# EAGLE schematic Sequencer-Logic-Prod-V2.1l (EAGLE 9.6.2)

## Sheet 1 of 10: uCode PC Counter
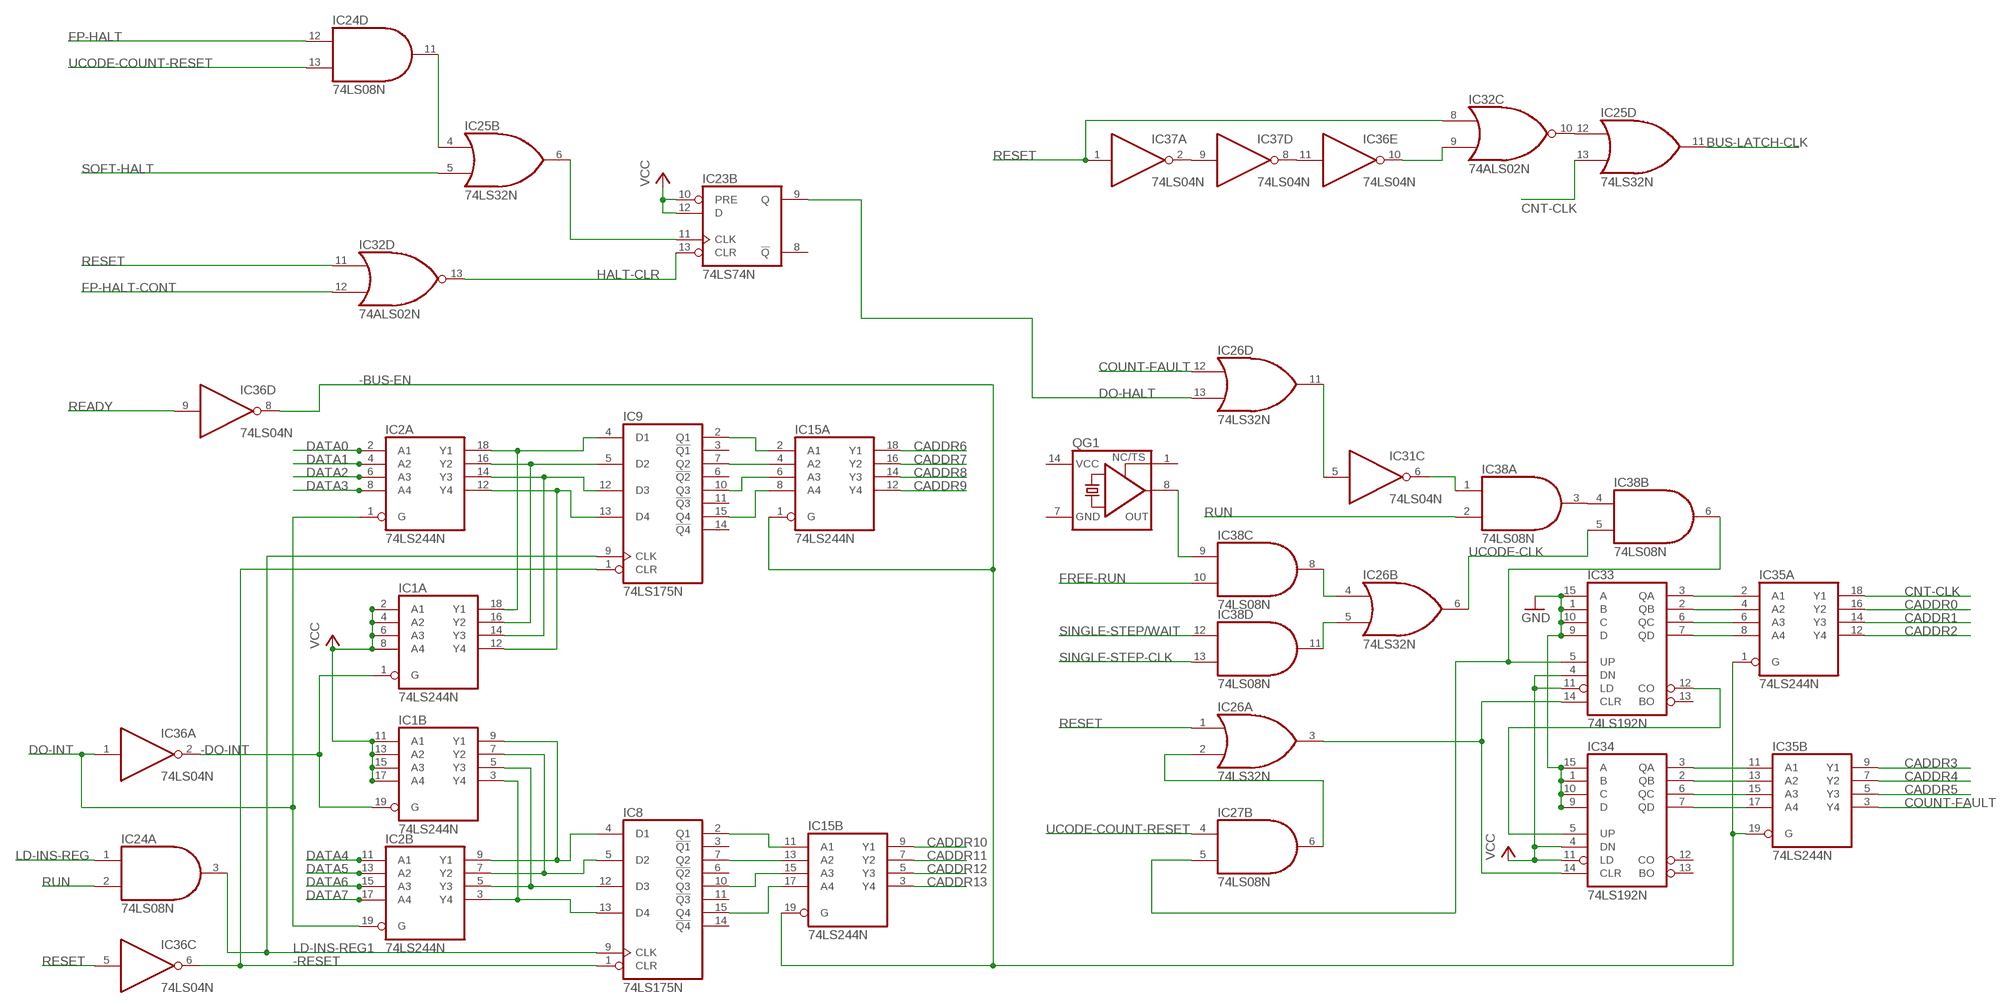
[diagram p0: schematic, sheet 1]

### Parts
IC1  74LS244N  [DIL20]
IC2  74LS244N  [DIL20]
IC8  74LS175N  [DIL16]
IC9  74LS175N  [DIL16]
IC15  74LS244N  [DIL20]
IC23  74LS74N  [DIL14]
IC24  74LS08N  [DIL14]
IC25  74LS32N  [DIL14]
IC26  74LS32N  [DIL14]
IC27  74LS08N  [DIL14]
IC31  74LS04N  [DIL14]
IC32  74ALS02N  [DIL14]
IC33  74LS192N  [DIL16]
IC34  74LS192N  [DIL16]
IC35  74LS244N  [DIL20]
IC36  74LS04N  [DIL14]
IC37  74LS04N  [DIL14]
IC38  74LS08N  [DIL14]
QG1  XO-14  [DIL14S]

### Nets
-BUS-EN: IC15.1(A:G) IC15.19(B:G) IC35.1(A:G) IC35.19(B:G) IC36.8(D:O) ; also sheet 2,10
-DO-INT: IC1.1(A:G) IC1.19(B:G) IC36.2(A:O)
-RESET: IC8.1(CLR) IC9.1(CLR) IC36.6(C:O) ; also sheet 10
BUS-LATCH-CLK: IC25.11(D:O) ; also sheet 2
CADDR0: IC35.16(A:Y2) ; also sheet 9
CADDR1: IC35.14(A:Y3) ; also sheet 9
CADDR2: IC35.12(A:Y4) ; also sheet 9
CADDR3: IC35.9(B:Y1) ; also sheet 9
CADDR4: IC35.7(B:Y2) ; also sheet 9
CADDR5: IC35.5(B:Y3) ; also sheet 9
CADDR6: IC15.18(A:Y1) ; also sheet 9
CADDR7: IC15.16(A:Y2) ; also sheet 9
CADDR8: IC15.14(A:Y3) ; also sheet 9
CADDR9: IC15.12(A:Y4) ; also sheet 9
CADDR10: IC15.9(B:Y1) ; also sheet 9
CADDR11: IC15.7(B:Y2) ; also sheet 9
CADDR12: IC15.5(B:Y3) ; also sheet 9
CADDR13: IC15.3(B:Y4) ; also sheet 9
CNT-CLK: IC25.13(D:I1) IC35.18(A:Y1)
COUNT-FAULT: IC26.12(D:I0) IC35.3(B:Y4)
COUNT-RESET: IC26.3(A:O) IC33.14(CLR) IC34.14(CLR)
DATA0: IC2.2(A:A1) ; also sheet 4,6,10
DATA1: IC2.4(A:A2) ; also sheet 4,6,10
DATA2: IC2.6(A:A3) ; also sheet 4,6,10
DATA3: IC2.8(A:A4) ; also sheet 4,6,10
DATA4: IC2.11(B:A1) ; also sheet 4,6,10
DATA5: IC2.13(B:A2) ; also sheet 4,6,10
DATA6: IC2.15(B:A3) ; also sheet 4,6,10
DATA7: IC2.17(B:A4) ; also sheet 4,6,10
DO-HALT: IC23.9(B:Q) IC26.13(D:I1)
DO-INT: IC2.1(A:G) IC2.19(B:G) IC36.1(A:I) ; also sheet 3
FP-HALT: IC24.12(D:I0) ; also sheet 5
FP-HALT-CONT: IC32.12(D:I1) ; also sheet 5
FREE-RUN: IC38.10(C:I1) ; also sheet 5
GND: IC33.1(B) IC33.9(D) IC33.10(C) IC33.15(A) IC34.1(B) IC34.9(D) IC34.10(C) IC34.15(A) ; also sheet 3,5,6,7,8,9,10
HALT-CLR: IC23.13(B:CLR) IC32.13(D:O)
LD-INS-REG: IC24.1(A:I0) ; also sheet 2
LD-INS-REG1: IC8.9(CLK) IC9.9(CLK) IC24.3(A:O)
N$1: IC33.12(CO) IC34.5(UP)
N$2: IC9.2(Q1) IC15.2(A:A1)
N$3: IC9.7(Q2) IC15.4(A:A2)
N$4: IC27.5(B:I1) IC33.5(UP) IC38.6(B:O)
N$5: IC1.18(A:Y1) IC2.18(A:Y1) IC9.4(D1)
N$6: IC1.16(A:Y2) IC2.16(A:Y2) IC9.5(D2)
N$7: IC33.3(QA) IC35.2(A:A1)
N$8: IC33.2(QB) IC35.4(A:A2)
N$9: IC33.6(QC) IC35.6(A:A3)
N$10: IC9.10(Q3) IC15.6(A:A3)
N$11: IC33.7(QD) IC35.8(A:A4)
N$12: IC34.3(QA) IC35.11(B:A1)
N$13: IC34.2(QB) IC35.13(B:A2)
N$14: IC34.6(QC) IC35.15(B:A3)
N$15: IC34.7(QD) IC35.17(B:A4)
N$16: IC31.6(C:O) IC38.1(A:I0)
N$17: IC1.14(A:Y3) IC2.14(A:Y3) IC9.12(D3)
N$18: IC1.12(A:Y4) IC2.12(A:Y4) IC9.13(D4)
N$19: IC1.9(B:Y1) IC2.9(B:Y1) IC8.4(D1)
N$20: IC1.7(B:Y2) IC2.7(B:Y2) IC8.5(D2)
N$21: IC1.5(B:Y3) IC2.5(B:Y3) IC8.12(D3)
N$22: IC1.3(B:Y4) IC2.3(B:Y4) IC8.13(D4)
N$23: IC9.15(Q4) IC15.8(A:A4)
N$26: IC26.11(D:O) IC31.5(C:I)
N$31: IC38.3(A:O) IC38.4(B:I0)
N$32: IC25.12(D:I0) IC32.10(C:O)
N$33: IC23.11(B:CLK) IC25.6(B:O)
N$34: IC8.2(Q1) IC15.11(B:A1)
N$35: IC8.7(Q2) IC15.13(B:A2)
N$36: IC8.10(Q3) IC15.15(B:A3)
N$37: IC8.15(Q4) IC15.17(B:A4)
N$38: IC26.5(B:I1) IC38.11(D:O)
N$39: IC26.4(B:I0) IC38.8(C:O)
N$40: IC38.9(C:I0) QG1.8(OUT)
N$42: IC36.11(E:I) IC37.8(D:O)
N$44: IC37.2(A:O) IC37.9(D:I)
N$46: IC32.9(C:I1) IC36.10(E:O)
N$54: IC24.11(D:O) IC25.4(B:I0)
N$55: IC26.2(A:I1) IC27.6(B:O)
READY: IC36.9(D:I) ; also sheet 9
RESET: IC26.1(A:I0) IC32.8(C:I0) IC32.11(D:I0) IC36.5(C:I) IC37.1(A:I) ; also sheet 3,5
RUN: IC24.2(A:I1) IC38.2(A:I1) ; also sheet 5
SINGLE-STEP-CLK: IC38.13(D:I1) ; also sheet 5
SINGLE-STEP/WAIT: IC38.12(D:I0) ; also sheet 5
SOFT-HALT: IC25.5(B:I1) ; also sheet 2
UCODE-CLK: IC26.6(B:O) IC38.5(B:I1)
UCODE-COUNT-RESET: IC24.13(D:I1) IC27.4(B:I0) ; also sheet 2,4,5
VCC: IC1.2(A:A1) IC1.4(A:A2) IC1.6(A:A3) IC1.8(A:A4) IC1.11(B:A1) IC1.13(B:A2) IC1.15(B:A3) IC1.17(B:A4) IC23.10(B:PRE) IC23.12(B:D) IC33.4(DN) IC33.11(LD) IC34.4(DN) IC34.11(LD) ; also sheet 3,5,7,9,10
Unconnected: IC8.3(!Q1) IC8.6(!Q2) IC8.11(!Q3) IC8.14(!Q4) IC9.3(!Q1) IC9.6(!Q2) IC9.11(!Q3) IC9.14(!Q4) IC23.8(B:!Q) IC33.13(BO) IC34.12(CO) IC34.13(BO) QG1.1(TS)

## Sheet 2 of 10: Latching
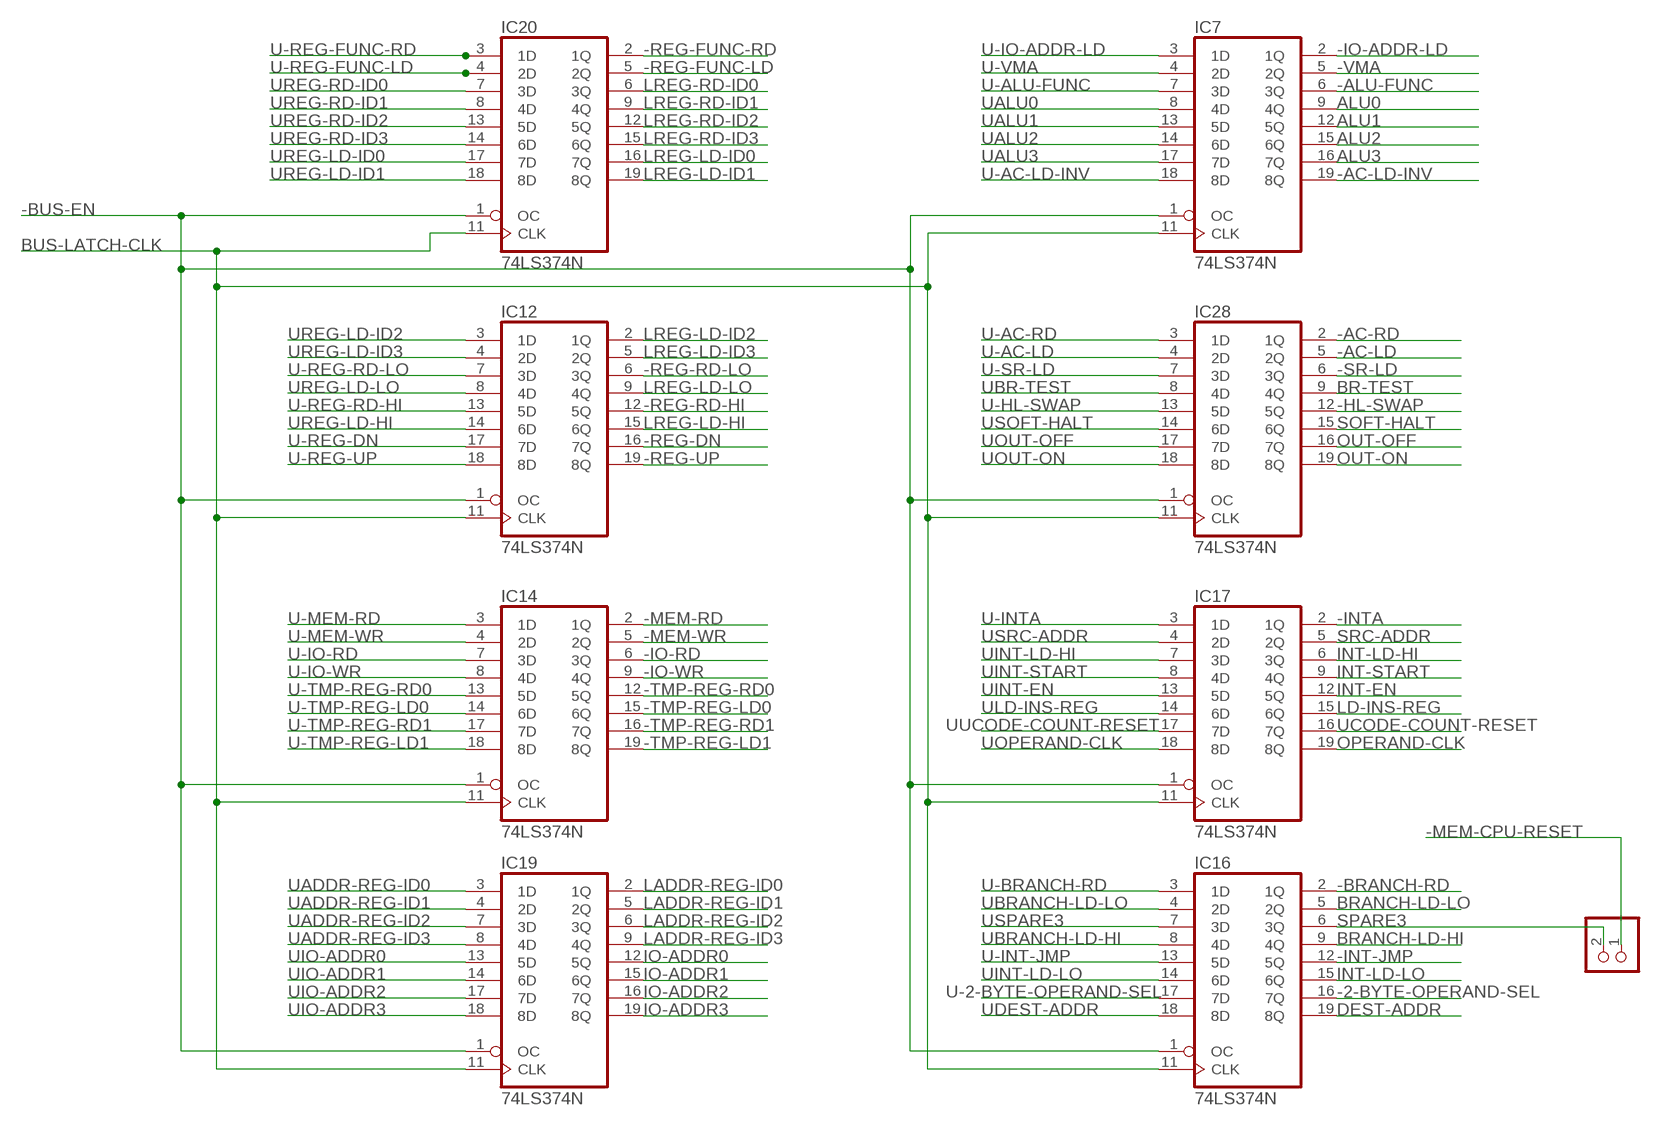
[diagram p1: schematic, sheet 2]

### Parts
IC7  74LS374N  [DIL20]
IC12  74LS374N  [DIL20]
IC14  74LS374N  [DIL20]
IC16  74LS374N  [DIL20]
IC17  74LS374N  [DIL20]
IC19  74LS374N  [DIL20]
IC20  74LS374N  [DIL20]
IC28  74LS374N  [DIL20]
JP2  PINHD-1X2  [1X02]

### Nets
-2-BYTE-OPERAND-SEL: IC16.16(7Q) ; also sheet 6
-AC-LD: IC28.5(2Q) ; also sheet 10
-AC-LD-INV: IC7.19(8Q) ; also sheet 10
-AC-RD: IC28.2(1Q) ; also sheet 10
-ALU-FUNC: IC7.6(3Q) ; also sheet 10
-BRANCH-RD: IC16.2(1Q) ; also sheet 4
-BUS-EN: IC7.1(OC) IC12.1(OC) IC14.1(OC) IC16.1(OC) IC17.1(OC) IC19.1(OC) IC20.1(OC) IC28.1(OC) ; also sheet 1,10
-HL-SWAP: IC28.12(5Q) ; also sheet 10
-INT-JMP: IC16.12(5Q) ; also sheet 4
-INTA: IC17.2(1Q) ; also sheet 10
-IO-ADDR-LD: IC7.2(1Q) ; also sheet 10
-IO-RD: IC14.6(3Q) ; also sheet 10
-IO-WR: IC14.9(4Q) ; also sheet 10
-MEM-CPU-RESET: JP2.1 ; also sheet 9
-MEM-RD: IC14.2(1Q) ; also sheet 10
-MEM-WR: IC14.5(2Q) ; also sheet 10
-REG-DN: IC12.16(7Q) ; also sheet 10
-REG-FUNC-LD: IC20.5(2Q) ; also sheet 10
-REG-FUNC-RD: IC20.2(1Q) ; also sheet 10
-REG-RD-HI: IC12.12(5Q) ; also sheet 10
-REG-RD-LO: IC12.6(3Q) ; also sheet 10
-REG-UP: IC12.19(8Q) ; also sheet 10
-SR-LD: IC28.6(3Q) ; also sheet 10
-TMP-REG-LD0: IC14.15(6Q) ; also sheet 10
-TMP-REG-LD1: IC14.19(8Q) ; also sheet 10
-TMP-REG-RD0: IC14.12(5Q) ; also sheet 10
-TMP-REG-RD1: IC14.16(7Q) ; also sheet 10
-VMA: IC7.5(2Q) ; also sheet 10
ALU0: IC7.9(4Q) ; also sheet 10
ALU1: IC7.12(5Q) ; also sheet 10
ALU2: IC7.15(6Q) ; also sheet 10
ALU3: IC7.16(7Q) ; also sheet 10
BR-TEST: IC28.9(4Q) ; also sheet 4
BRANCH-LD-HI: IC16.9(4Q) ; also sheet 4
BRANCH-LD-LO: IC16.5(2Q) ; also sheet 4
BUS-LATCH-CLK: IC7.11(CLK) IC12.11(CLK) IC14.11(CLK) IC16.11(CLK) IC17.11(CLK) IC19.11(CLK) IC20.11(CLK) IC28.11(CLK) ; also sheet 1
DEST-ADDR: IC16.19(8Q) ; also sheet 6
INT-EN: IC17.12(5Q) ; also sheet 3
INT-LD-HI: IC17.6(3Q) ; also sheet 4
INT-LD-LO: IC16.15(6Q) ; also sheet 4
INT-START: IC17.9(4Q) ; also sheet 3
IO-ADDR0: IC19.12(5Q) ; also sheet 10
IO-ADDR1: IC19.15(6Q) ; also sheet 10
IO-ADDR2: IC19.16(7Q) ; also sheet 10
IO-ADDR3: IC19.19(8Q) ; also sheet 10
LADDR-REG-ID0: IC19.2(1Q) ; also sheet 6
LADDR-REG-ID1: IC19.5(2Q) ; also sheet 6
LADDR-REG-ID2: IC19.6(3Q) ; also sheet 6
LADDR-REG-ID3: IC19.9(4Q) ; also sheet 6
LD-INS-REG: IC17.15(6Q) ; also sheet 1
LREG-LD-HI: IC12.15(6Q) ; also sheet 4
LREG-LD-ID0: IC20.16(7Q) ; also sheet 6
LREG-LD-ID1: IC20.19(8Q) ; also sheet 6
LREG-LD-ID2: IC12.2(1Q) ; also sheet 6
LREG-LD-ID3: IC12.5(2Q) ; also sheet 6
LREG-LD-LO: IC12.9(4Q) ; also sheet 4
LREG-RD-ID0: IC20.6(3Q) ; also sheet 6
LREG-RD-ID1: IC20.9(4Q) ; also sheet 6
LREG-RD-ID2: IC20.12(5Q) ; also sheet 6
LREG-RD-ID3: IC20.15(6Q) ; also sheet 6
OPERAND-CLK: IC17.19(8Q) ; also sheet 6
OUT-OFF: IC28.16(7Q) ; also sheet 3
OUT-ON: IC28.19(8Q) ; also sheet 3
SOFT-HALT: IC28.15(6Q) ; also sheet 1
SPARE3: IC16.6(3Q) JP2.2
SRC-ADDR: IC17.5(2Q) ; also sheet 6
U-2-BYTE-OPERAND-SEL: IC16.17(7D) ; also sheet 9
U-AC-LD: IC28.4(2D) ; also sheet 9
U-AC-LD-INV: IC7.18(8D) ; also sheet 9
U-AC-RD: IC28.3(1D) ; also sheet 9
U-ALU-FUNC: IC7.7(3D) ; also sheet 9
U-BRANCH-RD: IC16.3(1D) ; also sheet 9
U-HL-SWAP: IC28.13(5D) ; also sheet 9
U-INT-JMP: IC16.13(5D) ; also sheet 9
U-INTA: IC17.3(1D) ; also sheet 9
U-IO-ADDR-LD: IC7.3(1D) ; also sheet 9
U-IO-RD: IC14.7(3D) ; also sheet 9
U-IO-WR: IC14.8(4D) ; also sheet 9
U-MEM-RD: IC14.3(1D) ; also sheet 9
U-MEM-WR: IC14.4(2D) ; also sheet 9
U-REG-DN: IC12.17(7D) ; also sheet 9
U-REG-FUNC-LD: IC20.4(2D) ; also sheet 9
U-REG-FUNC-RD: IC20.3(1D) ; also sheet 9
U-REG-RD-HI: IC12.13(5D) ; also sheet 9
U-REG-RD-LO: IC12.7(3D) ; also sheet 9
U-REG-UP: IC12.18(8D) ; also sheet 9
U-SR-LD: IC28.7(3D) ; also sheet 9
U-TMP-REG-LD0: IC14.14(6D) ; also sheet 9
U-TMP-REG-LD1: IC14.18(8D) ; also sheet 9
U-TMP-REG-RD0: IC14.13(5D) ; also sheet 9
U-TMP-REG-RD1: IC14.17(7D) ; also sheet 9
U-VMA: IC7.4(2D) ; also sheet 9
UADDR-REG-ID0: IC19.3(1D) ; also sheet 9
UADDR-REG-ID1: IC19.4(2D) ; also sheet 9
UADDR-REG-ID2: IC19.7(3D) ; also sheet 9
UADDR-REG-ID3: IC19.8(4D) ; also sheet 9
UALU0: IC7.8(4D) ; also sheet 9
UALU1: IC7.13(5D) ; also sheet 9
UALU2: IC7.14(6D) ; also sheet 9
UALU3: IC7.17(7D) ; also sheet 9
UBR-TEST: IC28.8(4D) ; also sheet 9
UBRANCH-LD-HI: IC16.8(4D) ; also sheet 9
UBRANCH-LD-LO: IC16.4(2D) ; also sheet 9
UCODE-COUNT-RESET: IC17.16(7Q) ; also sheet 1,4,5
UDEST-ADDR: IC16.18(8D) ; also sheet 9
UINT-EN: IC17.13(5D) ; also sheet 9
UINT-LD-HI: IC17.7(3D) ; also sheet 9
UINT-LD-LO: IC16.14(6D) ; also sheet 9
UINT-START: IC17.8(4D) ; also sheet 9
UIO-ADDR0: IC19.13(5D) ; also sheet 9
UIO-ADDR1: IC19.14(6D) ; also sheet 9
UIO-ADDR2: IC19.17(7D) ; also sheet 9
UIO-ADDR3: IC19.18(8D) ; also sheet 9
ULD-INS-REG: IC17.14(6D) ; also sheet 9
UOPERAND-CLK: IC17.18(8D) ; also sheet 9
UOUT-OFF: IC28.17(7D) ; also sheet 9
UOUT-ON: IC28.18(8D) ; also sheet 9
UREG-LD-HI: IC12.14(6D) ; also sheet 9
UREG-LD-ID0: IC20.17(7D) ; also sheet 9
UREG-LD-ID1: IC20.18(8D) ; also sheet 9
UREG-LD-ID2: IC12.3(1D) ; also sheet 9
UREG-LD-ID3: IC12.4(2D) ; also sheet 9
UREG-LD-LO: IC12.8(4D) ; also sheet 9
UREG-RD-ID0: IC20.7(3D) ; also sheet 9
UREG-RD-ID1: IC20.8(4D) ; also sheet 9
UREG-RD-ID2: IC20.13(5D) ; also sheet 9
UREG-RD-ID3: IC20.14(6D) ; also sheet 9
USOFT-HALT: IC28.14(6D) ; also sheet 9
USPARE3: IC16.7(3D) ; also sheet 9
USRC-ADDR: IC17.4(2D) ; also sheet 9
UUCODE-COUNT-RESET: IC17.17(7D) ; also sheet 9

## Sheet 3 of 10: Interrupt Mgmt
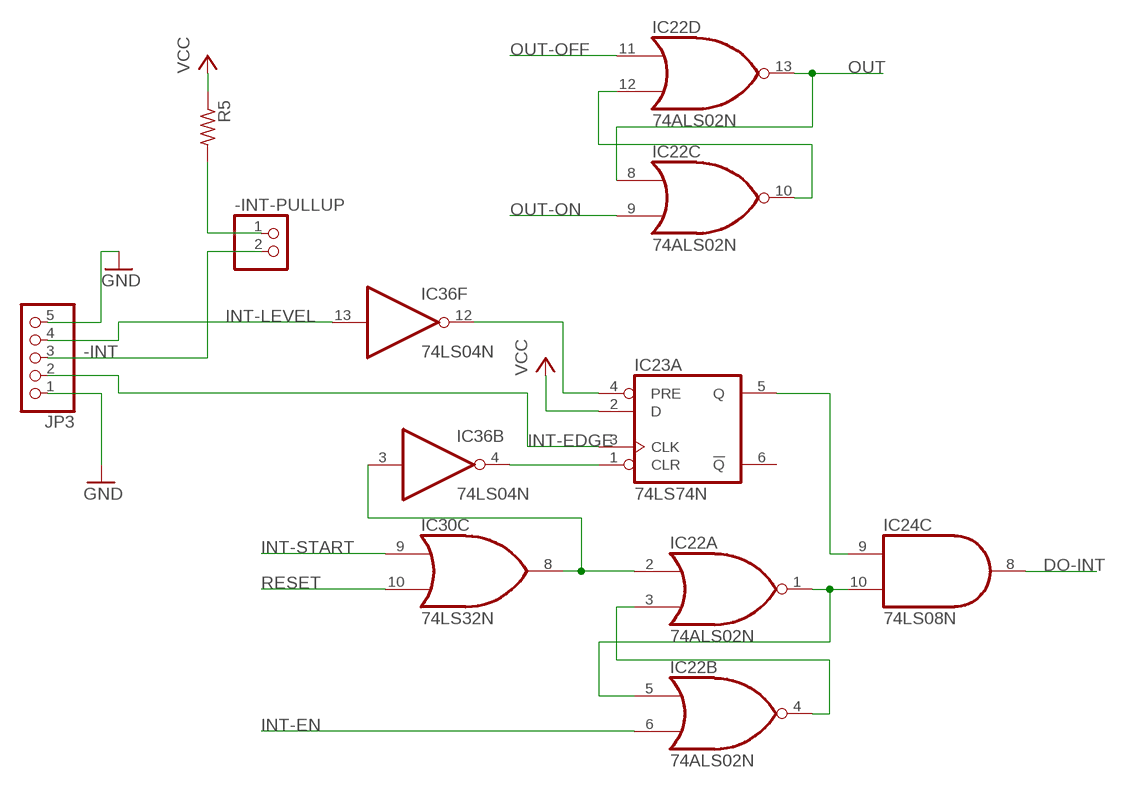
[diagram p2: schematic, sheet 3]

### Parts
-INT-PULLUP  PINHD-1X2  [1X02]
IC22  74ALS02N  [DIL14]
IC30  74LS32N  [DIL14]
JP3  PINHD-1X5  [1X05]
R5  10k  R-US_0207/10  [0207/10]

### Nets
-INT: -INT-PULLUP.2 JP3.3 ; also sheet 10
DO-INT: IC24.8(C:O) ; also sheet 1
GND: JP3.1 JP3.5 ; also sheet 1,5,6,7,8,9,10
INT-EDGE: IC23.3(A:CLK) JP3.2
INT-EN: IC22.6(B:I1) ; also sheet 2
INT-LEVEL: IC36.13(F:I) JP3.4
INT-START: IC30.9(C:I0) ; also sheet 2
N$24: IC22.1(A:O) IC22.5(B:I0) IC24.10(C:I1)
N$25: IC22.3(A:I1) IC22.4(B:O)
N$27: IC22.2(A:I0) IC30.8(C:O) IC36.3(B:I)
N$28: IC23.5(A:Q) IC24.9(C:I0)
N$29: IC23.1(A:CLR) IC36.4(B:O)
N$41: IC23.4(A:PRE) IC36.12(F:O)
N$48: IC22.10(C:O) IC22.12(D:I1)
N$49: -INT-PULLUP.1 R5.2
OUT: IC22.8(C:I0) IC22.13(D:O) ; also sheet 5,10
OUT-OFF: IC22.11(D:I0) ; also sheet 2
OUT-ON: IC22.9(C:I1) ; also sheet 2
RESET: IC30.10(C:I1) ; also sheet 1,5
VCC: IC23.2(A:D) R5.1 ; also sheet 1,5,7,9,10
Unconnected: IC23.6(A:!Q)

## Sheet 4 of 10: Branch Mgmt
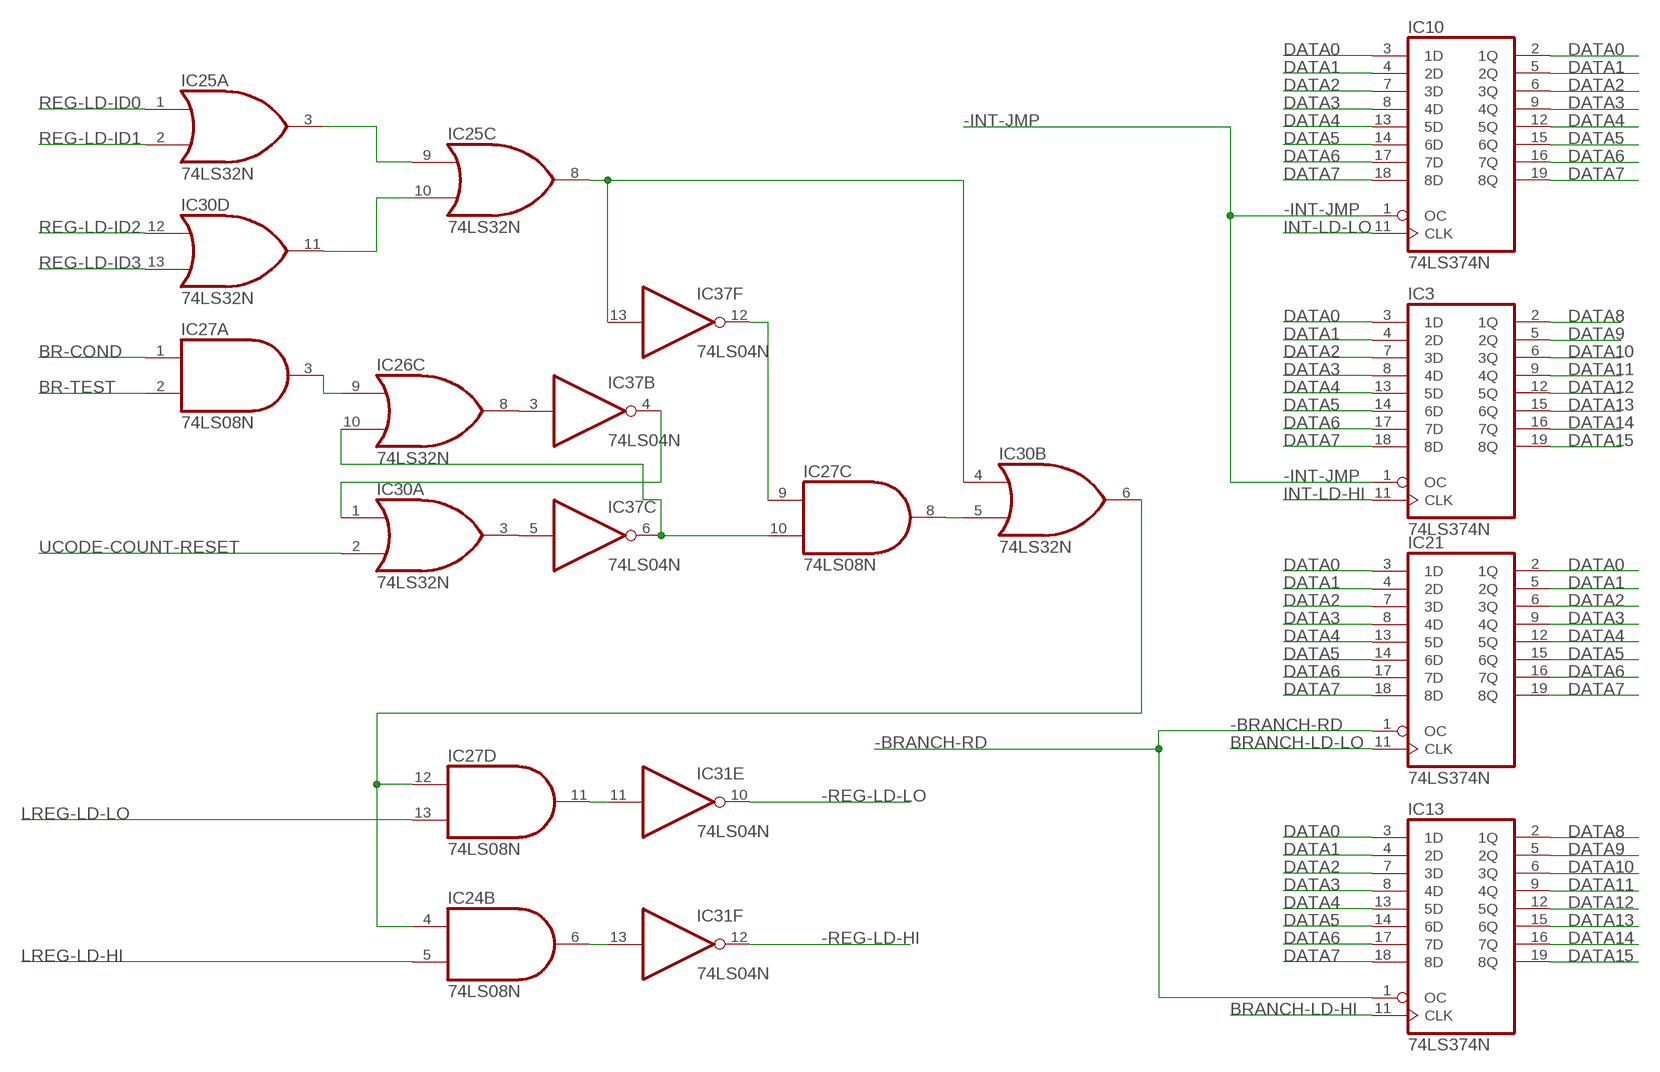
[diagram p3: schematic, sheet 4]

### Parts
IC3  74LS374N  [DIL20]
IC10  74LS374N  [DIL20]
IC13  74LS374N  [DIL20]
IC21  74LS374N  [DIL20]

### Nets
-BRANCH-RD: IC13.1(OC) IC21.1(OC) ; also sheet 2
-INT-JMP: IC3.1(OC) IC10.1(OC) ; also sheet 2
-REG-LD-HI: IC31.12(F:O) ; also sheet 10
-REG-LD-LO: IC31.10(E:O) ; also sheet 10
BR-COND: IC27.1(A:I0) ; also sheet 10
BR-TEST: IC27.2(A:I1) ; also sheet 2
BRANCH-LD-HI: IC13.11(CLK) ; also sheet 2
BRANCH-LD-LO: IC21.11(CLK) ; also sheet 2
DATA0: IC3.3(1D) IC10.2(1Q) IC10.3(1D) IC13.3(1D) IC21.2(1Q) IC21.3(1D) ; also sheet 1,6,10
DATA1: IC3.4(2D) IC10.4(2D) IC10.5(2Q) IC13.4(2D) IC21.4(2D) IC21.5(2Q) ; also sheet 1,6,10
DATA2: IC3.7(3D) IC10.6(3Q) IC10.7(3D) IC13.7(3D) IC21.6(3Q) IC21.7(3D) ; also sheet 1,6,10
DATA3: IC3.8(4D) IC10.8(4D) IC10.9(4Q) IC13.8(4D) IC21.8(4D) IC21.9(4Q) ; also sheet 1,6,10
DATA4: IC3.13(5D) IC10.12(5Q) IC10.13(5D) IC13.13(5D) IC21.12(5Q) IC21.13(5D) ; also sheet 1,6,10
DATA5: IC3.14(6D) IC10.14(6D) IC10.15(6Q) IC13.14(6D) IC21.14(6D) IC21.15(6Q) ; also sheet 1,6,10
DATA6: IC3.17(7D) IC10.16(7Q) IC10.17(7D) IC13.17(7D) IC21.16(7Q) IC21.17(7D) ; also sheet 1,6,10
DATA7: IC3.18(8D) IC10.18(8D) IC10.19(8Q) IC13.18(8D) IC21.18(8D) IC21.19(8Q) ; also sheet 1,6,10
DATA8: IC3.2(1Q) IC13.2(1Q) ; also sheet 10
DATA9: IC3.5(2Q) IC13.5(2Q) ; also sheet 10
DATA10: IC3.6(3Q) IC13.6(3Q) ; also sheet 10
DATA11: IC3.9(4Q) IC13.9(4Q) ; also sheet 10
DATA12: IC3.12(5Q) IC13.12(5Q) ; also sheet 10
DATA13: IC3.15(6Q) IC13.15(6Q) ; also sheet 10
DATA14: IC3.16(7Q) IC13.16(7Q) ; also sheet 10
DATA15: IC3.19(8Q) IC13.19(8Q) ; also sheet 10
INT-LD-HI: IC3.11(CLK) ; also sheet 2
INT-LD-LO: IC10.11(CLK) ; also sheet 2
LREG-LD-HI: IC24.5(B:I1) ; also sheet 2
LREG-LD-LO: IC27.13(D:I1) ; also sheet 2
N$45: IC25.3(A:O) IC25.9(C:I0)
N$47: IC25.10(C:I1) IC30.11(D:O)
N$51: IC27.9(C:I0) IC37.12(F:O)
N$52: IC27.8(C:O) IC30.5(B:I1)
N$53: IC24.4(B:I0) IC27.12(D:I0) IC30.6(B:O)
N$56: IC25.8(C:O) IC30.4(B:I0) IC37.13(F:I)
N$57: IC27.11(D:O) IC31.11(E:I)
N$58: IC24.6(B:O) IC31.13(F:I)
N$60: IC26.8(C:O) IC37.3(B:I)
N$67: IC30.3(A:O) IC37.5(C:I)
N$70: IC30.1(A:I0) IC37.4(B:O)
N$71: IC26.10(C:I1) IC27.10(C:I1) IC37.6(C:O)
N$72: IC26.9(C:I0) IC27.3(A:O)
REG-LD-ID0: IC25.1(A:I0) ; also sheet 6,10
REG-LD-ID1: IC25.2(A:I1) ; also sheet 6,10
REG-LD-ID2: IC30.12(D:I0) ; also sheet 6,10
REG-LD-ID3: IC30.13(D:I1) ; also sheet 6,10
UCODE-COUNT-RESET: IC30.2(A:I1) ; also sheet 1,2,5

## Sheet 5 of 10: CONTROL INTERFACE
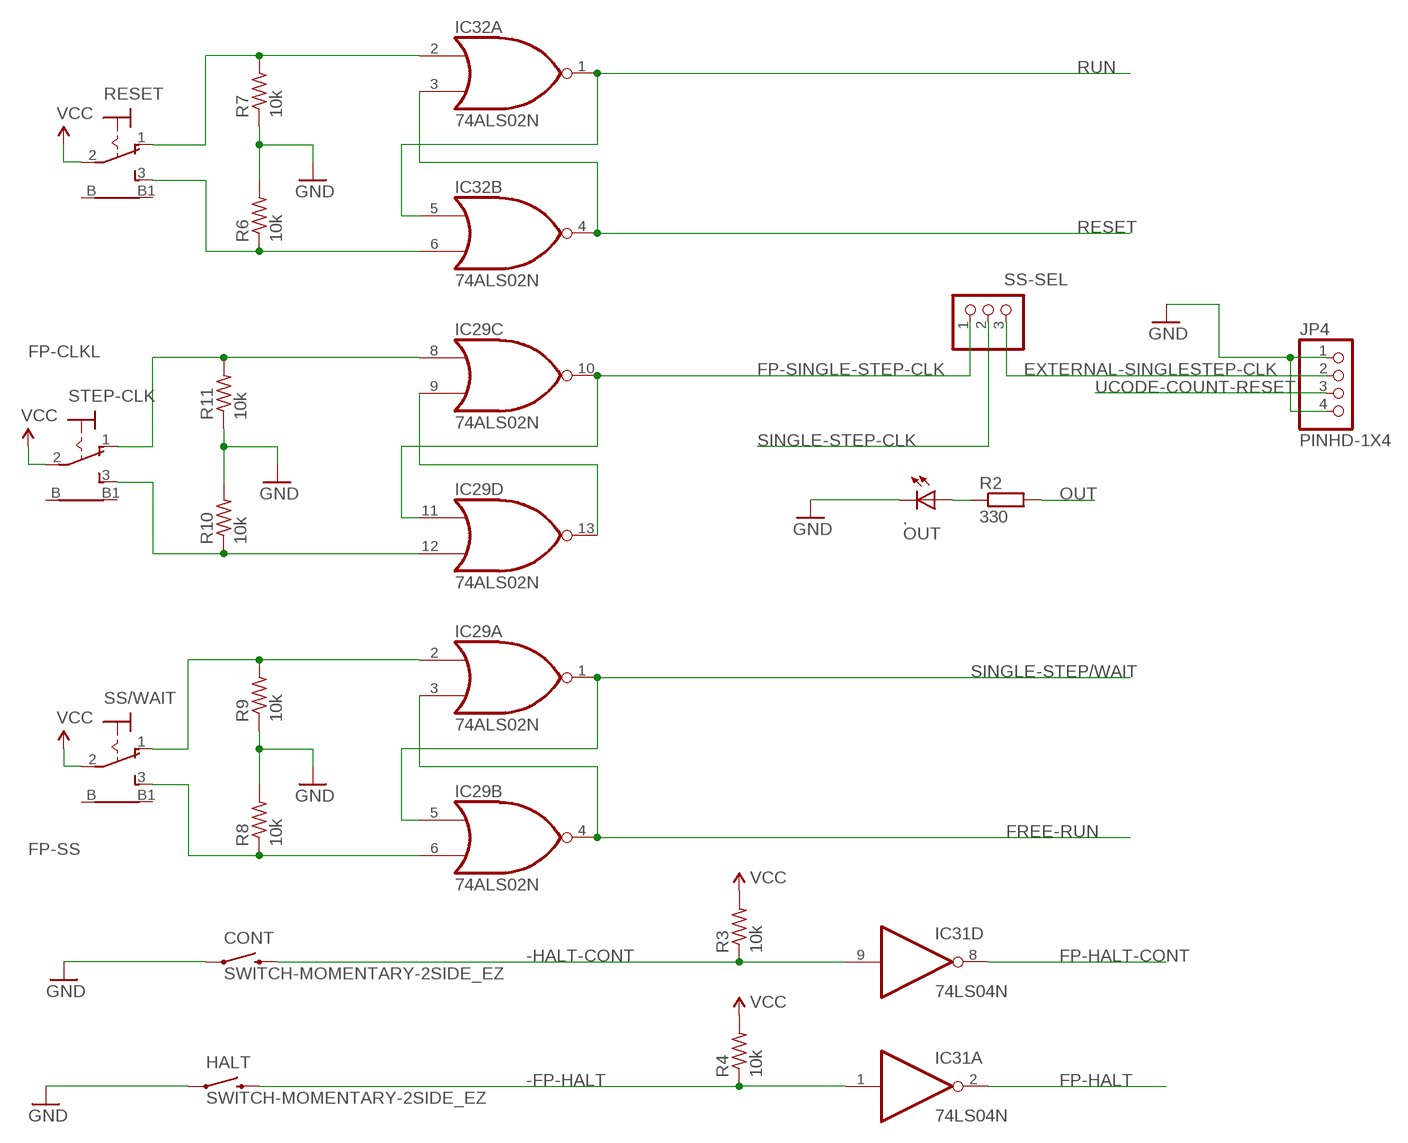
[diagram p4: schematic, sheet 5]

### Parts
.  OUT  LED5MM  [LED5MM]
CONT  SWITCH-MOMENTARY-2SIDE_EZ  [TACTILE-PTH-SIDEEZ]
HALT  SWITCH-MOMENTARY-2SIDE_EZ  [TACTILE-PTH-SIDEEZ]
IC29  74ALS02N  [DIL14]
JP4  PINHD-1X4  [1X04]
R2  330  R0207/10  [0207/10]
R3  10k  R-US_0207/10  [0207/10]
R4  10k  R-US_0207/10  [0207/10]
R6  10k  R-US_0207/10  [0207/10]
R7  10k  R-US_0207/10  [0207/10]
R8  10k  R-US_0207/10  [0207/10]
R9  10k  R-US_0207/10  [0207/10]
R10  10k  R-US_0207/10  [0207/10]
R11  10k  R-US_0207/10  [0207/10]
RESET  9070-1W  [9070-1W]
SS-SEL  PINHD-1X3  [1X03]
SS/WAIT  9070-1W  [9070-1W]
STEP-CLK  9070-1W  [9070-1W]

### Nets
-FP-HALT: HALT.2 IC31.1(A:I) R4.1
-HALT-CONT: CONT.2 IC31.9(D:I) R3.1
EXTERNAL-SINGLESTEP-CLK: JP4.2 SS-SEL.3
FP-CLKH: IC29.12(D:I1) R10.1 STEP-CLK.3(S)
FP-CLKL: IC29.8(C:I0) R11.2 STEP-CLK.1(O)
FP-EXECUTE: IC32.6(B:I1) R6.1 RESET.3(S)
FP-FREERUN: IC29.2(A:I0) R9.2 SS/WAIT.1(O)
FP-HALT: IC31.2(A:O) ; also sheet 1
FP-HALT-CONT: IC31.8(D:O) ; also sheet 1
FP-RESET: IC32.2(A:I0) R7.2 RESET.1(O)
FP-SINGLE-STEP-CLK: IC29.10(C:O) IC29.11(D:I0) SS-SEL.1
FP-SS: IC29.6(B:I1) R8.1 SS/WAIT.3(S)
FREE-RUN: IC29.3(A:I1) IC29.4(B:O) ; also sheet 1
GND: ..K(C) CONT.1 HALT.1 JP4.1 JP4.4 R6.2 R7.1 R8.2 R9.1 R10.2 R11.1 ; also sheet 1,3,6,7,8,9,10
HARD-RESET1: IC29.9(C:I1) IC29.13(D:O)
N$59: ..A R2.1
OUT: R2.2 ; also sheet 3,10
RESET: IC32.3(A:I1) IC32.4(B:O) ; also sheet 1,3
RUN: IC32.1(A:O) IC32.5(B:I0) ; also sheet 1
SINGLE-STEP-CLK: SS-SEL.2 ; also sheet 1
SINGLE-STEP/WAIT: IC29.1(A:O) IC29.5(B:I0) ; also sheet 1
UCODE-COUNT-RESET: JP4.3 ; also sheet 1,2,4
VCC: R3.2 R4.2 RESET.2(P) SS/WAIT.2(P) STEP-CLK.2(P) ; also sheet 1,3,7,9,10
Unconnected: RESET.B RESET.B1 SS/WAIT.B SS/WAIT.B1 STEP-CLK.B STEP-CLK.B1

## Sheet 6 of 10: OPERAND REGISTER MGMT
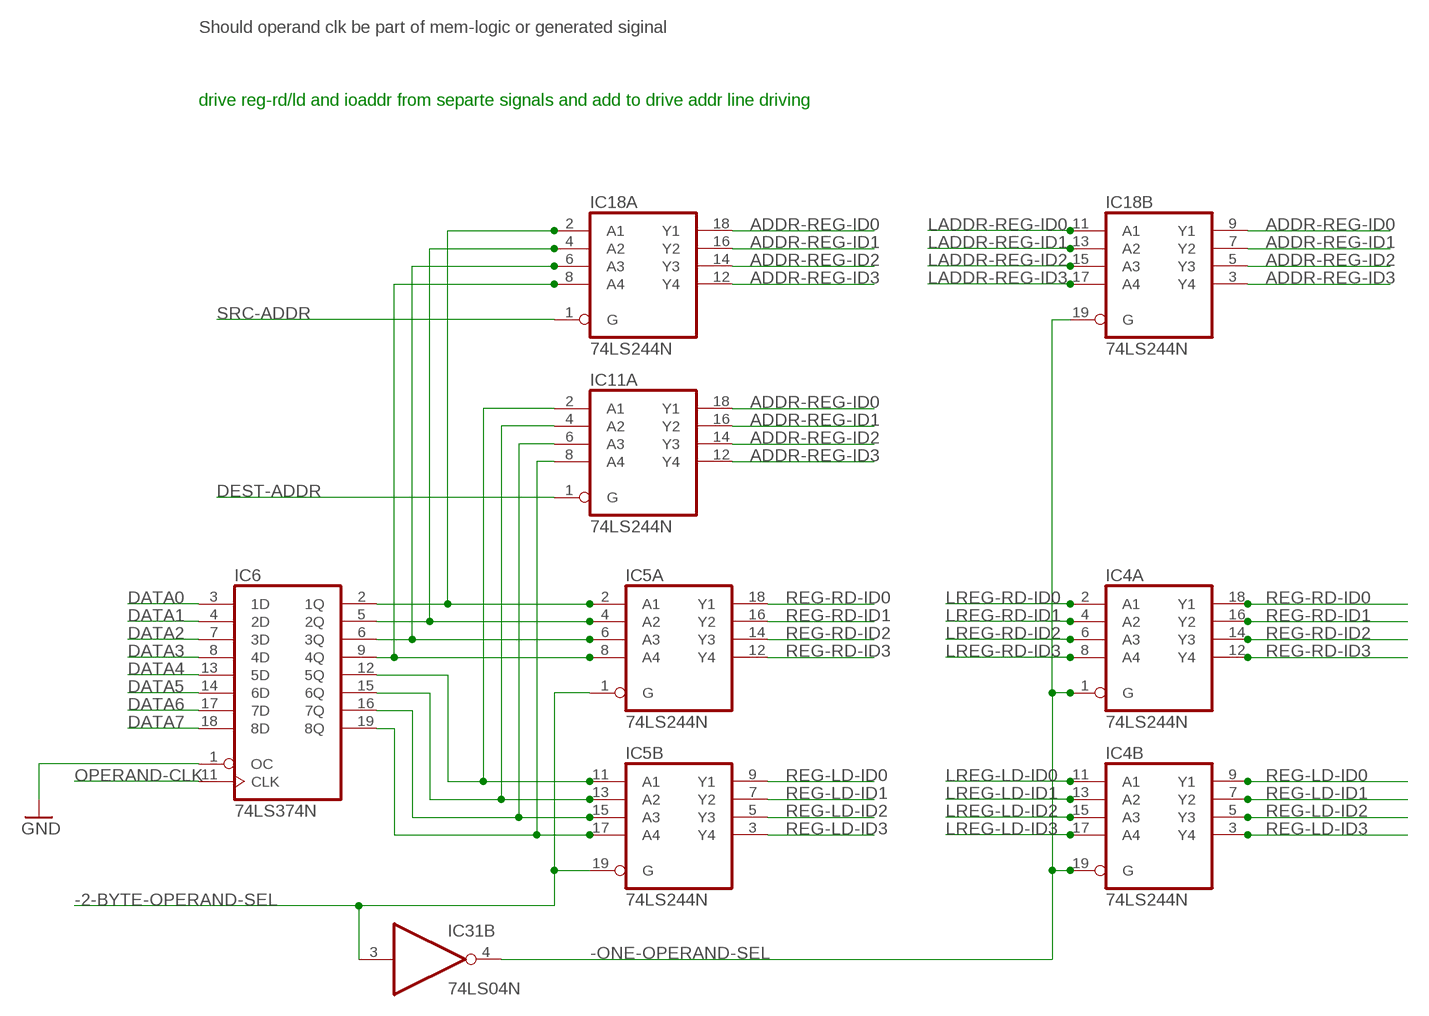
[diagram p5: schematic, sheet 6]

### Parts
IC4  74LS244N  [DIL20]
IC5  74LS244N  [DIL20]
IC6  74LS374N  [DIL20]
IC11  74LS244N  [DIL20]
IC18  74LS244N  [DIL20]

### Nets
-2-BYTE-OPERAND-SEL: IC5.1(A:G) IC5.19(B:G) IC31.3(B:I) ; also sheet 2
-ONE-OPERAND-SEL: IC4.1(A:G) IC4.19(B:G) IC18.19(B:G) IC31.4(B:O)
ADDR-REG-ID0: IC11.18(A:Y1) IC18.9(B:Y1) IC18.18(A:Y1) ; also sheet 10
ADDR-REG-ID1: IC11.16(A:Y2) IC18.7(B:Y2) IC18.16(A:Y2) ; also sheet 10
ADDR-REG-ID2: IC11.14(A:Y3) IC18.5(B:Y3) IC18.14(A:Y3) ; also sheet 10
ADDR-REG-ID3: IC11.12(A:Y4) IC18.3(B:Y4) IC18.12(A:Y4) ; also sheet 10
DATA0: IC6.3(1D) ; also sheet 1,4,10
DATA1: IC6.4(2D) ; also sheet 1,4,10
DATA2: IC6.7(3D) ; also sheet 1,4,10
DATA3: IC6.8(4D) ; also sheet 1,4,10
DATA4: IC6.13(5D) ; also sheet 1,4,10
DATA5: IC6.14(6D) ; also sheet 1,4,10
DATA6: IC6.17(7D) ; also sheet 1,4,10
DATA7: IC6.18(8D) ; also sheet 1,4,10
DEST-ADDR: IC11.1(A:G) ; also sheet 2
GND: IC6.1(OC) ; also sheet 1,3,5,7,8,9,10
LADDR-REG-ID0: IC18.11(B:A1) ; also sheet 2
LADDR-REG-ID1: IC18.13(B:A2) ; also sheet 2
LADDR-REG-ID2: IC18.15(B:A3) ; also sheet 2
LADDR-REG-ID3: IC18.17(B:A4) ; also sheet 2
LREG-LD-ID0: IC4.11(B:A1) ; also sheet 2
LREG-LD-ID1: IC4.13(B:A2) ; also sheet 2
LREG-LD-ID2: IC4.15(B:A3) ; also sheet 2
LREG-LD-ID3: IC4.17(B:A4) ; also sheet 2
LREG-RD-ID0: IC4.2(A:A1) ; also sheet 2
LREG-RD-ID1: IC4.4(A:A2) ; also sheet 2
LREG-RD-ID2: IC4.6(A:A3) ; also sheet 2
LREG-RD-ID3: IC4.8(A:A4) ; also sheet 2
N$61: IC5.17(B:A4) IC6.19(8Q) IC11.8(A:A4)
N$62: IC5.2(A:A1) IC6.2(1Q) IC18.2(A:A1)
N$63: IC5.4(A:A2) IC6.5(2Q) IC18.4(A:A2)
N$64: IC5.6(A:A3) IC6.6(3Q) IC18.6(A:A3)
N$65: IC5.8(A:A4) IC6.9(4Q) IC18.8(A:A4)
N$66: IC5.11(B:A1) IC6.12(5Q) IC11.2(A:A1)
N$68: IC5.13(B:A2) IC6.15(6Q) IC11.4(A:A2)
N$69: IC5.15(B:A3) IC6.16(7Q) IC11.6(A:A3)
OPERAND-CLK: IC6.11(CLK) ; also sheet 2
REG-LD-ID0: IC4.9(B:Y1) IC5.9(B:Y1) ; also sheet 4,10
REG-LD-ID1: IC4.7(B:Y2) IC5.7(B:Y2) ; also sheet 4,10
REG-LD-ID2: IC4.5(B:Y3) IC5.5(B:Y3) ; also sheet 4,10
REG-LD-ID3: IC4.3(B:Y4) IC5.3(B:Y4) ; also sheet 4,10
REG-RD-ID0: IC4.18(A:Y1) IC5.18(A:Y1) ; also sheet 10
REG-RD-ID1: IC4.16(A:Y2) IC5.16(A:Y2) ; also sheet 10
REG-RD-ID2: IC4.14(A:Y3) IC5.14(A:Y3) ; also sheet 10
REG-RD-ID3: IC4.12(A:Y4) IC5.12(A:Y4) ; also sheet 10
SRC-ADDR: IC18.1(A:G) ; also sheet 2

### Notes on the sheet
- Should operand clk be part of mem-logic or generated siginal
- drive reg-rd/ld and ioaddr from separte signals and add to drive addr line driving

## Sheet 7 of 10: BYPASS and UNUSED
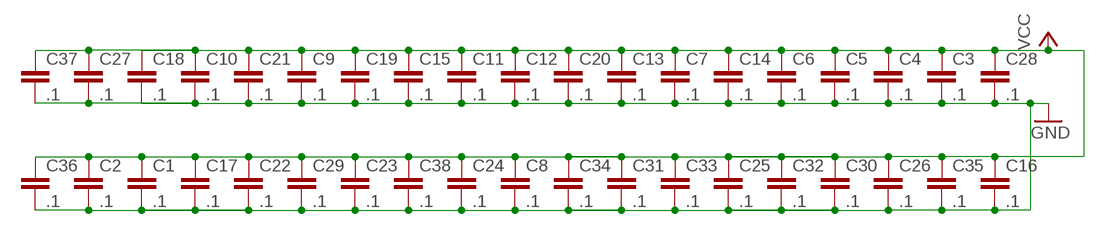
[diagram p6: schematic, sheet 7]

### Parts
C1  .1  CAPEZ  [CAP-PTH-SMALLEZ]
C2  .1  CAPEZ  [CAP-PTH-SMALLEZ]
C3  .1  CAPEZ  [CAP-PTH-SMALLEZ]
C4  .1  CAPEZ  [CAP-PTH-SMALLEZ]
C5  .1  CAPEZ  [CAP-PTH-SMALLEZ]
C6  .1  CAPEZ  [CAP-PTH-SMALLEZ]
C7  .1  CAPEZ  [CAP-PTH-SMALLEZ]
C8  .1  CAPEZ  [CAP-PTH-SMALLEZ]
C9  .1  CAPEZ  [CAP-PTH-SMALLEZ]
C10  .1  CAPEZ  [CAP-PTH-SMALLEZ]
C11  .1  CAPEZ  [CAP-PTH-SMALLEZ]
C12  .1  CAPEZ  [CAP-PTH-SMALLEZ]
C13  .1  CAPEZ  [CAP-PTH-SMALLEZ]
C14  .1  CAPEZ  [CAP-PTH-SMALLEZ]
C15  .1  CAPEZ  [CAP-PTH-SMALLEZ]
C16  .1  CAPEZ  [CAP-PTH-SMALLEZ]
C17  .1  CAPEZ  [CAP-PTH-SMALLEZ]
C18  .1  CAPEZ  [CAP-PTH-SMALLEZ]
C19  .1  CAPEZ  [CAP-PTH-SMALLEZ]
C20  .1  CAPEZ  [CAP-PTH-SMALLEZ]
C21  .1  CAPEZ  [CAP-PTH-SMALLEZ]
C22  .1  CAPEZ  [CAP-PTH-SMALLEZ]
C23  .1  CAPEZ  [CAP-PTH-SMALLEZ]
C24  .1  CAPEZ  [CAP-PTH-SMALLEZ]
C25  .1  CAPEZ  [CAP-PTH-SMALLEZ]
C26  .1  CAPEZ  [CAP-PTH-SMALLEZ]
C27  .1  CAPEZ  [CAP-PTH-SMALLEZ]
C28  .1  CAPEZ  [CAP-PTH-SMALLEZ]
C29  .1  CAPEZ  [CAP-PTH-SMALLEZ]
C30  .1  CAPEZ  [CAP-PTH-SMALLEZ]
C31  .1  CAPEZ  [CAP-PTH-SMALLEZ]
C32  .1  CAPEZ  [CAP-PTH-SMALLEZ]
C33  .1  CAPEZ  [CAP-PTH-SMALLEZ]
C34  .1  CAPEZ  [CAP-PTH-SMALLEZ]
C35  .1  CAPEZ  [CAP-PTH-SMALLEZ]
C36  .1  CAPEZ  [CAP-PTH-SMALLEZ]
C37  .1  CAPEZ  [CAP-PTH-SMALLEZ]
C38  .1  CAPEZ  [CAP-PTH-SMALLEZ]

### Nets
GND: C1.2 C2.2 C3.2 C4.2 C5.2 C6.2 C7.2 C8.2 C9.2 C10.2 C11.2 C12.2 C13.2 C14.2 C15.2 C16.2 C17.2 C18.2 C19.2 C20.2 C21.2 C22.2 C23.2 C24.2 C25.2 C26.2 C27.2 C28.2 C29.2 C30.2 C31.2 C32.2 C33.2 C34.2 C35.2 C36.2 C37.2 C38.2 ; also sheet 1,3,5,6,8,9,10
VCC: C1.1 C2.1 C3.1 C4.1 C5.1 C6.1 C7.1 C8.1 C9.1 C10.1 C11.1 C12.1 C13.1 C14.1 C15.1 C16.1 C17.1 C18.1 C19.1 C20.1 C21.1 C22.1 C23.1 C24.1 C25.1 C26.1 C27.1 C28.1 C29.1 C30.1 C31.1 C32.1 C33.1 C34.1 C35.1 C36.1 C37.1 C38.1 ; also sheet 1,3,5,9,10

## Sheet 8 of 10: BUS
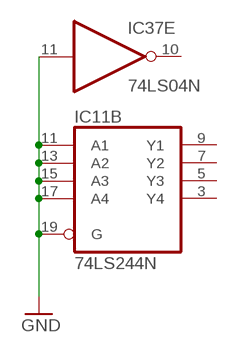
[diagram p7: schematic, sheet 8]

### Nets
GND: IC11.11(B:A1) IC11.13(B:A2) IC11.15(B:A3) IC11.17(B:A4) IC11.19(B:G) IC37.11(E:I) ; also sheet 1,3,5,6,7,9,10
Unconnected: IC11.3(B:Y4) IC11.5(B:Y3) IC11.7(B:Y2) IC11.9(B:Y1) IC37.10(E:O)

## Sheet 9 of 10
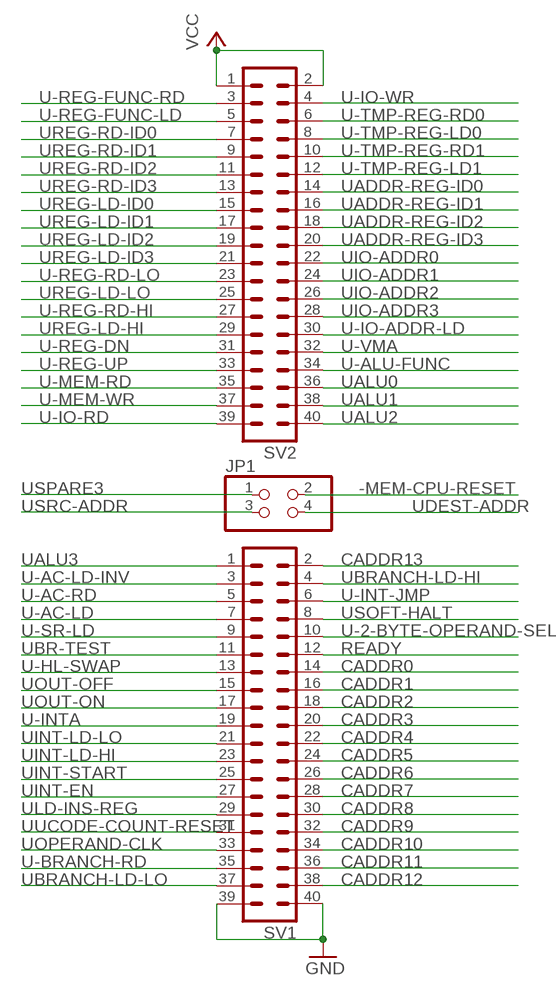
[diagram p8: schematic, sheet 9]

### Parts
JP1  PINHD-2X2  [2X02]
SV1  MA20-2  [MA20-2]
SV2  MA20-2  [MA20-2]

### Nets
-MEM-CPU-RESET: JP1.2 ; also sheet 2
CADDR0: SV1.14 ; also sheet 1
CADDR1: SV1.16 ; also sheet 1
CADDR2: SV1.18 ; also sheet 1
CADDR3: SV1.20 ; also sheet 1
CADDR4: SV1.22 ; also sheet 1
CADDR5: SV1.24 ; also sheet 1
CADDR6: SV1.26 ; also sheet 1
CADDR7: SV1.28 ; also sheet 1
CADDR8: SV1.30 ; also sheet 1
CADDR9: SV1.32 ; also sheet 1
CADDR10: SV1.34 ; also sheet 1
CADDR11: SV1.36 ; also sheet 1
CADDR12: SV1.38 ; also sheet 1
CADDR13: SV1.2 ; also sheet 1
GND: SV1.39 SV1.40 ; also sheet 1,3,5,6,7,8,10
READY: SV1.12 ; also sheet 1
U-2-BYTE-OPERAND-SEL: SV1.10 ; also sheet 2
U-AC-LD: SV1.7 ; also sheet 2
U-AC-LD-INV: SV1.3 ; also sheet 2
U-AC-RD: SV1.5 ; also sheet 2
U-ALU-FUNC: SV2.34 ; also sheet 2
U-BRANCH-RD: SV1.35 ; also sheet 2
U-HL-SWAP: SV1.13 ; also sheet 2
U-INT-JMP: SV1.6 ; also sheet 2
U-INTA: SV1.19 ; also sheet 2
U-IO-ADDR-LD: SV2.30 ; also sheet 2
U-IO-RD: SV2.39 ; also sheet 2
U-IO-WR: SV2.4 ; also sheet 2
U-MEM-RD: SV2.35 ; also sheet 2
U-MEM-WR: SV2.37 ; also sheet 2
U-REG-DN: SV2.31 ; also sheet 2
U-REG-FUNC-LD: SV2.5 ; also sheet 2
U-REG-FUNC-RD: SV2.3 ; also sheet 2
U-REG-RD-HI: SV2.27 ; also sheet 2
U-REG-RD-LO: SV2.23 ; also sheet 2
U-REG-UP: SV2.33 ; also sheet 2
U-SR-LD: SV1.9 ; also sheet 2
U-TMP-REG-LD0: SV2.8 ; also sheet 2
U-TMP-REG-LD1: SV2.12 ; also sheet 2
U-TMP-REG-RD0: SV2.6 ; also sheet 2
U-TMP-REG-RD1: SV2.10 ; also sheet 2
U-VMA: SV2.32 ; also sheet 2
UADDR-REG-ID0: SV2.14 ; also sheet 2
UADDR-REG-ID1: SV2.16 ; also sheet 2
UADDR-REG-ID2: SV2.18 ; also sheet 2
UADDR-REG-ID3: SV2.20 ; also sheet 2
UALU0: SV2.36 ; also sheet 2
UALU1: SV2.38 ; also sheet 2
UALU2: SV2.40 ; also sheet 2
UALU3: SV1.1 ; also sheet 2
UBR-TEST: SV1.11 ; also sheet 2
UBRANCH-LD-HI: SV1.4 ; also sheet 2
UBRANCH-LD-LO: SV1.37 ; also sheet 2
UDEST-ADDR: JP1.4 ; also sheet 2
UINT-EN: SV1.27 ; also sheet 2
UINT-LD-HI: SV1.23 ; also sheet 2
UINT-LD-LO: SV1.21 ; also sheet 2
UINT-START: SV1.25 ; also sheet 2
UIO-ADDR0: SV2.22 ; also sheet 2
UIO-ADDR1: SV2.24 ; also sheet 2
UIO-ADDR2: SV2.26 ; also sheet 2
UIO-ADDR3: SV2.28 ; also sheet 2
ULD-INS-REG: SV1.29 ; also sheet 2
UOPERAND-CLK: SV1.33 ; also sheet 2
UOUT-OFF: SV1.15 ; also sheet 2
UOUT-ON: SV1.17 ; also sheet 2
UREG-LD-HI: SV2.29 ; also sheet 2
UREG-LD-ID0: SV2.15 ; also sheet 2
UREG-LD-ID1: SV2.17 ; also sheet 2
UREG-LD-ID2: SV2.19 ; also sheet 2
UREG-LD-ID3: SV2.21 ; also sheet 2
UREG-LD-LO: SV2.25 ; also sheet 2
UREG-RD-ID0: SV2.7 ; also sheet 2
UREG-RD-ID1: SV2.9 ; also sheet 2
UREG-RD-ID2: SV2.11 ; also sheet 2
UREG-RD-ID3: SV2.13 ; also sheet 2
USOFT-HALT: SV1.8 ; also sheet 2
USPARE3: JP1.1 ; also sheet 2
USRC-ADDR: JP1.3 ; also sheet 2
UUCODE-COUNT-RESET: SV1.31 ; also sheet 2
VCC: SV2.1 SV2.2 ; also sheet 1,3,5,7,10

## Sheet 10 of 10
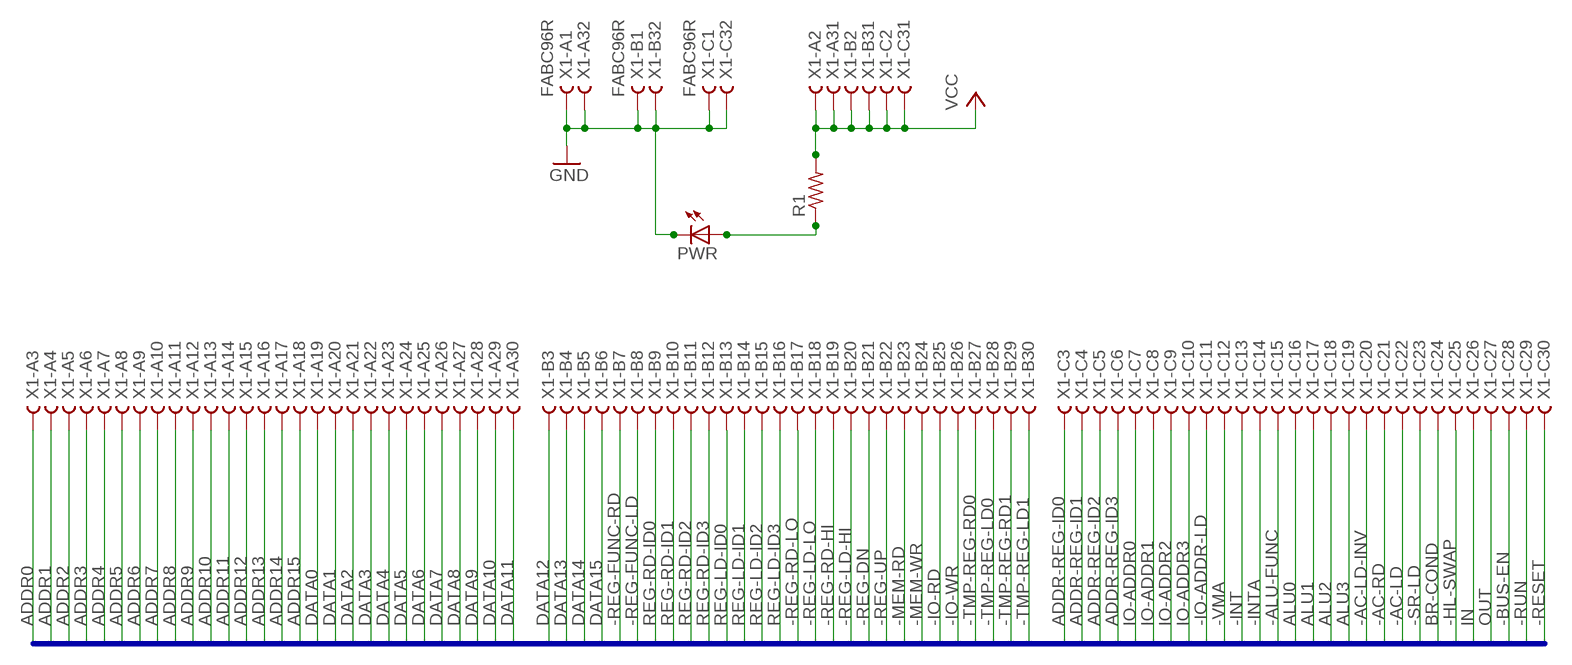
[diagram p9: schematic, sheet 10]

### Parts
PWR  LED5MM  [LED5MM]
R1  10k  R-US_0207/10  [0207/10]
X1  FABC96R  [FABC96R]

### Nets
-AC-LD: X1.C22 ; also sheet 2
-AC-LD-INV: X1.C20 ; also sheet 2
-AC-RD: X1.C21 ; also sheet 2
-ALU-FUNC: X1.C15 ; also sheet 2
-BUS-EN: X1.C28 ; also sheet 1,2
-HL-SWAP: X1.C25 ; also sheet 2
-INT: X1.C13 ; also sheet 3
-INTA: X1.C14 ; also sheet 2
-IO-ADDR-LD: X1.C11 ; also sheet 2
-IO-RD: X1.B25 ; also sheet 2
-IO-WR: X1.B26 ; also sheet 2
-MEM-RD: X1.B23 ; also sheet 2
-MEM-WR: X1.B24 ; also sheet 2
-REG-DN: X1.B21 ; also sheet 2
-REG-FUNC-LD: X1.B8 ; also sheet 2
-REG-FUNC-RD: X1.B7 ; also sheet 2
-REG-LD-HI: X1.B20 ; also sheet 4
-REG-LD-LO: X1.B18 ; also sheet 4
-REG-RD-HI: X1.B19 ; also sheet 2
-REG-RD-LO: X1.B17 ; also sheet 2
-REG-UP: X1.B22 ; also sheet 2
-RESET: X1.C30 ; also sheet 1
-RUN: X1.C29
-SR-LD: X1.C23 ; also sheet 2
-TMP-REG-LD0: X1.B28 ; also sheet 2
-TMP-REG-LD1: X1.B30 ; also sheet 2
-TMP-REG-RD0: X1.B27 ; also sheet 2
-TMP-REG-RD1: X1.B29 ; also sheet 2
-VMA: X1.C12 ; also sheet 2
ADDR0: X1.A3
ADDR1: X1.A4
ADDR2: X1.A5
ADDR3: X1.A6
ADDR4: X1.A7
ADDR5: X1.A8
ADDR6: X1.A9
ADDR7: X1.A10
ADDR8: X1.A11
ADDR9: X1.A12
ADDR10: X1.A13
ADDR11: X1.A14
ADDR12: X1.A15
ADDR13: X1.A16
ADDR14: X1.A17
ADDR15: X1.A18
ADDR-REG-ID0: X1.C3 ; also sheet 6
ADDR-REG-ID1: X1.C4 ; also sheet 6
ADDR-REG-ID2: X1.C5 ; also sheet 6
ADDR-REG-ID3: X1.C6 ; also sheet 6
ALU0: X1.C16 ; also sheet 2
ALU1: X1.C17 ; also sheet 2
ALU2: X1.C18 ; also sheet 2
ALU3: X1.C19 ; also sheet 2
BR-COND: X1.C24 ; also sheet 4
DATA0: X1.A19 ; also sheet 1,4,6
DATA1: X1.A20 ; also sheet 1,4,6
DATA2: X1.A21 ; also sheet 1,4,6
DATA3: X1.A22 ; also sheet 1,4,6
DATA4: X1.A23 ; also sheet 1,4,6
DATA5: X1.A24 ; also sheet 1,4,6
DATA6: X1.A25 ; also sheet 1,4,6
DATA7: X1.A26 ; also sheet 1,4,6
DATA8: X1.A27 ; also sheet 4
DATA9: X1.A28 ; also sheet 4
DATA10: X1.A29 ; also sheet 4
DATA11: X1.A30 ; also sheet 4
DATA12: X1.B3 ; also sheet 4
DATA13: X1.B4 ; also sheet 4
DATA14: X1.B5 ; also sheet 4
DATA15: X1.B6 ; also sheet 4
GND: PWR.K(C) X1.A1 X1.A32 X1.B1 X1.B32 X1.C1 X1.C32 ; also sheet 1,3,5,6,7,8,9
IN: X1.C26
IO-ADDR0: X1.C7 ; also sheet 2
IO-ADDR1: X1.C8 ; also sheet 2
IO-ADDR2: X1.C9 ; also sheet 2
IO-ADDR3: X1.C10 ; also sheet 2
N$30: PWR.A R1.1
OUT: X1.C27 ; also sheet 3,5
REG-LD-ID0: X1.B13 ; also sheet 4,6
REG-LD-ID1: X1.B14 ; also sheet 4,6
REG-LD-ID2: X1.B15 ; also sheet 4,6
REG-LD-ID3: X1.B16 ; also sheet 4,6
REG-RD-ID0: X1.B9 ; also sheet 6
REG-RD-ID1: X1.B10 ; also sheet 6
REG-RD-ID2: X1.B11 ; also sheet 6
REG-RD-ID3: X1.B12 ; also sheet 6
VCC: R1.2 X1.A2 X1.A31 X1.B2 X1.B31 X1.C2 X1.C31 ; also sheet 1,3,5,7,9

### Buses
MAINBUS:-AC-LD,-AC-LD-INV,-AC-RD,ADDR[0..15],ADDR-REG-ID0,ADDR-REG-ID1,ADDR-REG-ID2,ADDR-REG-ID3,ALU[0..3],-ALU-FUNC,BR-COND,-BUS-EN,DATA[0..15],-HL-SWAP,IN,-INT,-INTA,IO-ADDR[0..3],-IO-ADDR-LD,-IO-RD,-IO-WR,-MEM-RD,-MEM-WR,OUT,-REG-DN,-REG-FUNC-LD,-REG-FUNC-RD,-REG-LD-HI,REG-LD-ID[0..3],-REG-LD-LO,-REG-RD-HI,REG-RD-ID[0..3],-REG-RD-LO,-REG-UP,-RESET,-RUN,-SR-LD,-TMP-REG-LD[0..1],-TMP-REG-RD[0..1],-VMA

## Power pins joined to a net without a drawn wire
GND: IC1.10(P:GND) IC2.10(P:GND) IC3.10(GND) IC4.10(P:GND) IC5.10(P:GND) IC6.10(GND) IC7.10(GND) IC8.8(GND) IC9.8(GND) IC10.10(GND) IC11.10(P:GND) IC12.10(GND) IC13.10(GND) IC14.10(GND) IC15.10(P:GND) IC16.10(GND) IC17.10(GND) IC18.10(P:GND) IC19.10(GND) IC20.10(GND) IC21.10(GND) IC22.7(P:GND) IC23.7(P:GND) IC24.7(P:GND) IC25.7(P:GND) IC26.7(P:GND) IC27.7(P:GND) IC28.10(GND) IC29.7(P:GND) IC30.7(P:GND) IC31.7(P:GND) IC32.7(P:GND) IC33.8(GND) IC34.8(GND) IC35.10(P:GND) IC36.7(P:GND) IC37.7(P:GND) IC38.7(P:GND) QG1.7(GND)
VCC: IC1.20(P:VCC) IC2.20(P:VCC) IC3.20(VCC) IC4.20(P:VCC) IC5.20(P:VCC) IC6.20(VCC) IC7.20(VCC) IC8.16(VCC) IC9.16(VCC) IC10.20(VCC) IC11.20(P:VCC) IC12.20(VCC) IC13.20(VCC) IC14.20(VCC) IC15.20(P:VCC) IC16.20(VCC) IC17.20(VCC) IC18.20(P:VCC) IC19.20(VCC) IC20.20(VCC) IC21.20(VCC) IC22.14(P:VCC) IC23.14(P:VCC) IC24.14(P:VCC) IC25.14(P:VCC) IC26.14(P:VCC) IC27.14(P:VCC) IC28.20(VCC) IC29.14(P:VCC) IC30.14(P:VCC) IC31.14(P:VCC) IC32.14(P:VCC) IC33.16(VCC) IC34.16(VCC) IC35.20(P:VCC) IC36.14(P:VCC) IC37.14(P:VCC) IC38.14(P:VCC) QG1.14(VCC)

## Library data of the parts
-INT-PULLUP = pinhead:PINHD-1X2: PIN HEADER
. PWR = led:LED: LED OSRAM: - CHIPLED LG R971, LG N971, LY N971, LG Q971, LY Q971, LO R971, LY R971 LH N974, LH R974 LS Q976, LO Q976, LY Q976 LO Q996 - Hyper CHIPLED LW Q18S LB Q993, LB Q99A, LB R99A - SideLED LS A670, LO A670, LY A670, LG A670, LP A670 LB A673, LV A673, LT A673, LW A673 LH A674 LY A675 LS A676, LA A676, LO A676, LY A676, LW A676 LS A679, LY A679, LG A679 - Hyper Micro SIDELED® LS Y876, LA Y876, LO Y876, LY Y876 LT Y87S - SmartLED LW L88C, LW L88S LB L89C, LB L89S, LG L890 LS L89K, LO L89K, LY L89K LS L896, LA L896, LO L896, LY L896 - TOPLED LS T670, LO T670, LY T670, LG T670, LP T670 LSG T670, LSP T670, LSY T670, LOP T670, LYG T670 LG T671, LOG T671, LSG T671 LB T673, LV T673, LT T673, LW T673 LH T674 LS T676, LA T676, LO T676, LY T676, LB T676, LH T676, LSB T676, LW T676 LB T67C, LV T67C, LT T67C, LS T67K, LO T67K, LY T67K, LW E67C LS E67B, LA E67B, LO E67B, LY E67B, LB E67C, LV E67C, LT E67C LW T67C LS T679, LY T679, LG T679 LS T770, LO T770, LY T770, LG T770, LP T770 LB T773, LV T773, LT T773, LW T773 LH T774 LS E675, LA E675, LY E675, LS T675 LS T776, LA T776, LO T776, LY T776, LB T776 LHGB T686 LT T68C, LB T68C - Hyper Mini TOPLED® LB M676 - Mini TOPLED Santana® LG M470 LS M47K, LO M47K, LY M47K Source: http://www.osram.convergy.de LUXEON: - LUMILED® LXK2-PW12-R00, LXK2-PW12-S00, LXK2-PW14-U00, LXK2-PW14-V00 LXK2-PM12-R00, LXK2-PM12-S00, LXK2-PM14-U00 LXK2-PE12-Q00, LXK2-PE12-R00, LXK2-PE12-S00, LXK2-PE14-T00, LXK2-PE14-U00 LXK2-PB12-K00, LXK2-PB12-L00, LXK2-PB12-M00, LXK2-PB14-N00, LXK2-PB14-P00, LXK2-PB14-Q00 LXK2-PR12-L00, LXK2-PR12-M00, LXK2-PR14-Q00, LXK2-PR14-R00 LXK2-PD12-Q00, LXK2-PD12-R00, LXK2-PD12-S00 LXK2-PH12-R00, LXK2-PH12-S00 LXK2-PL12-P00, LXK2-PL12-Q00, LXK2-PL12-R00 Source: www.luxeon.com KINGBRIGHT: KA-3528ASYC Source: www.kingbright.com
C1-C38 = SparkFun-Capacitors:CAP: Capacitor Standard 0603 ceramic capacitor, and 0.1" leaded capacitor.
CONT HALT = SparkFun-Electromechanical:SWITCH-MOMENTARY-2: Various NO switches- pushbuttons, reed, etc
IC1 IC2 IC4 IC5 IC11 IC15 IC18 IC35 = 74xx-us:74*244: Octal BUFFER and LINE DRIVER, 3-state
IC3 IC6 IC7 IC10 IC12-IC14 IC16 IC17 IC19-IC21 IC28 = 74xx-us:74*374: Octal D type transparent LATCH, edge triggered
IC8 IC9 = 74xx-us:74*175: Qadruple D type FLIP FLOP, clear
IC22 IC29 IC32 = 74xx-us:74*02: Quad 2-input NOR gate
IC23 = 74xx-us:74*74: Dual D type positive edge triggered FLIP FLOP, preset and clear
IC24 IC27 IC38 = 74xx-us:74*08: Quad 2-input AND gate
IC25 IC26 IC30 = 74xx-us:74*32: Quad 2-input OR gate
IC31 IC36 IC37 = 74xx-us:74*04: Hex INVERTER
IC33 IC34 = 74xx-us:74*192: Synchronous 4-bit UP/DOWN COUNTER
JP1 = pinhead:PINHD-2X2: PIN HEADER
JP2 = Connector:PINHD-1X2: PIN HEADER; CATEGORY: CONNECTOR; SUB-CATEGORY: PIN-HEADER
JP3 = pinhead:PINHD-1X5: PIN HEADER
JP4 = Connector:PINHD-1X4: PIN HEADER; CATEGORY: CONNECTOR; SUB-CATEGORY: PIN-HEADER
QG1 = crystal:XO-: CRYSTAL; OC_FARNELL: unknown; OC_NEWARK: unknown
R1 R3-R11 = adafruit:R-US_: RESISTOR, American symbol
R2 = eagle-ltspice:R: RESISTOR, European symbol; SPICEMODEL: NONE; SPICEPREFIX: R
RESET SS/WAIT STEP-CLK = switch:9070-1W: TOGGLE SWITCH Marquardt
SS-SEL = pinhead:PINHD-1X3: PIN HEADER
SV1 SV2 = con-lstb:MA20-2: PIN HEADER; OC_FARNELL: unknown; OC_NEWARK: unknown
X1 = con-vg:FABC96R: CONNECTOR female, 96 pins, type R, rows ABC, grid 2.54 mm